# Altium project PCB_Project.PrjPcb
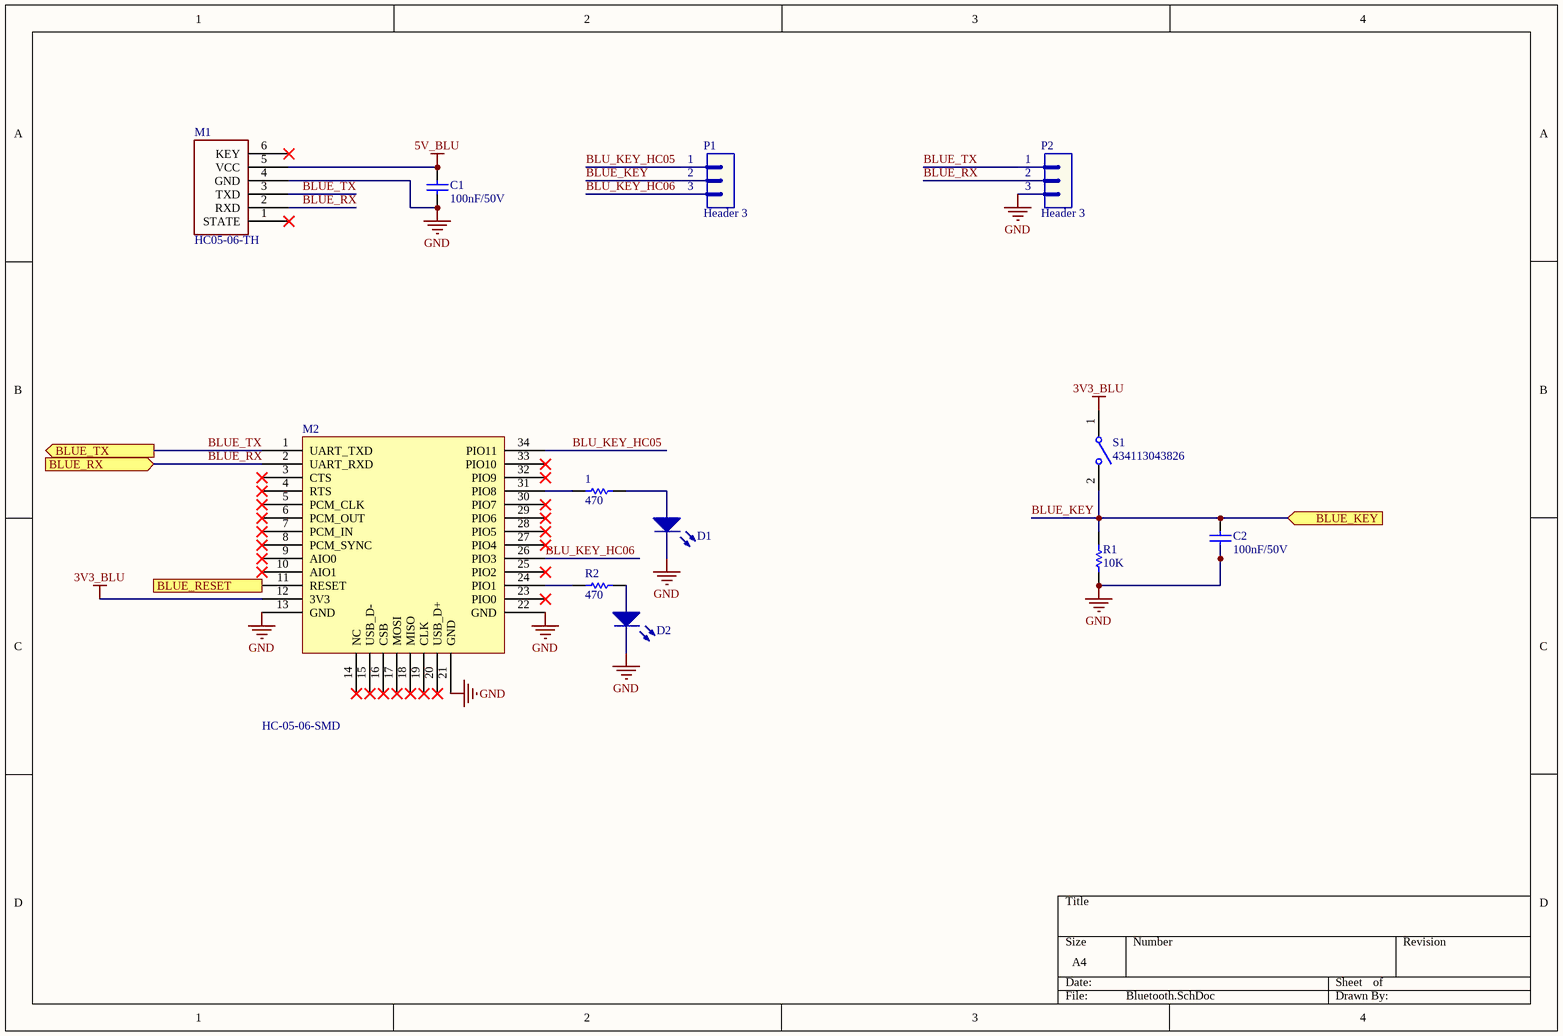
[diagram p0: Bluetooth.SchDoc]
5 sheets, 92 parts. Net scope: flat (ports and power ports of the same name join across sheets).
Board file: PCB1.PcbDoc
Sheets:
  Bluetooth.SchDoc
  MCU.SchDoc
  Motor Control.SchDoc
  Sensor.SchDoc
  Wifi.SchDoc

## Sheet Bluetooth.SchDoc
size A4

### Parts
1  value 470  [RES-SM-0805]  (hidden comment: Res-1K-0805)
C1  value 100nF/50V  [CAP-SM-0805]  (hidden comment: Cap-1nF-50V-0805)
C2  value 100nF/50V  [CAP-SM-0805]  (hidden comment: Cap-1nF-50V-0805)
D1  LED  [LED_0603_Blue]  (value not drawn)
D2  LED  [LED_0603_Blue]  (value not drawn)
M1  HC05-06-TH  [HC-05-06-TH]
M2  HC-05-06-SMD  [HC-05-06-SMD]
P1  Header 3  [JP3]
P2  Header 3  [JP3]
R1  value 10K  [RES-SM-0805]  (hidden comment: Res-0-0805)
R2  value 470  [RES-SM-0805]  (hidden comment: Res-1K-0805)
S1  434113043826  [434113043826]

### Ports
BLUE_KEY (in), BLUE_RESET (in), BLUE_RX (in), BLUE_TX (out)

### Nets
3V3_BLU: M2.12(3V3) S1.1
5V_BLU: C1.2 M1.5(VCC)
GND: C1.1 C2.1 D1.2(K) D2.2(K) M1.4(GND) M2.13(GND) M2.21(GND) M2.22(GND) P2.3 R1.2
BLU_KEY_HC05: M2.34(PIO11) P1.1
BLU_KEY_HC06: M2.26(PIO3) P1.3
BLUE_KEY: C2.2 P1.2 R1.1 S1.2 ; port BLUE_KEY
BLUE_RX: M1.2(RXD) M2.2(UART_RXD) P2.2 ; port BLUE_RX
BLUE_TX: M1.3(TXD) M2.1(UART_TXD) P2.1 ; port BLUE_TX
Net1_1: 1.1 M2.31(PIO8)
Net1_2: 1.2 D1.1(A)
NetCR1_14: M2.11(RESET) ; port BLUE_RESET
NetD2_1: D2.1(A) R2.2
NetM2_24: M2.24(PIO1) R2.1

Not connected (* = marked no-connect by the designer): M1 1(STATE)* 6(KEY)*; M2 3(CTS)* 4(RTS)* 5(PCM_CLK)* 6(PCM_OUT)* 7(PCM_IN)* 8(PCM_SYNC)* 9(AIO0)* 10(AIO1)* 14(NC)* 15(USB_D-)* 16(CSB)* 17(MOSI)* 18(MISO)* 19(CLK)* 20(USB_D+)* 23(PIO0)* 25(PIO2)* 27(PIO4)* 28(PIO5)* 29(PIO6)* 30(PIO7)* 32(PIO9)* 33(PIO10)*

### Library data of the parts
1 R2 = Res-1K-0805: RES 1K OHM 1% 1/4W 0805; Manufacturer: Stackpole Electronics Inc; Manufacturer Part Number: RNCP0805FTD1K00; Local Supplier: thegioiic; Local Supplier Link: https://thegioiic.com/products/dien-tro-1k-ohm-0805-5; Supplier 1: Digikey; Supplier 1 Link: https://www.digikey.com/product-detail/en/stackpole-electronics-inc/RNCP0805FTD1K00/RNCP0805FTD1K00CT-ND/2240568; Supplier 1 Part Number: RNCP0805FTD1K00CT-ND
C1 C2 = Cap-1nF-50V-0805: CAP CER 1000PF 100V X7R 0805; Manufacturer: Johanson Dielectrics Inc.; Manufacturer Part Number: 101X15W102MV4E; Local Supplier: thegioiic; Local Supplier Link: https://thegioiic.com/products/tu-1nf-50v-0805; Supplier 1: Digikey; Supplier 1 Link: https://www.digikey.com/product-detail/en/johanson-dielectrics-inc/101X15W102MV4E/709-1335-1-ND/2327235; Supplier 1 Part Number: 709-1335-1-ND
M2 = HC-05-06-SMD: Local supply: Hshop
P1 P2 = Header 3: Header, 3-Pin; LatestRevisionDate: 17-Jul-2002; LatestRevisionNote: Re-released for DXP Platform.; Publisher: Altium Limited
R1 = Res-0-0805: RES 0 OHM JUMPER 0805; Manufacturer: Vishay Dale; Manufacturer Part Number: WSL080500000ZEA9; Local Supplier: thegioiic; Local Supplier Link: https://thegioiic.com/products/dien-tro-0-ohm-0805-5; Supplier 1: Digikey; Supplier 1 Link: https://www.digikey.com/product-detail/en/vishay-dale/WSL080500000ZEA9/541-3928-1-ND/7423223; Supplier 1 Part Number: 541-3928-1-ND
S1 = 434113043826: WS-TASV J-Bend SMT Tact Switch 6x3.5mm, height 4.3mm, 260gf; Rated Voltage: 12VDC; Rated Current: 50mA; Washable: No; ComponentLink1Description: Manufacturer; ComponentLink1URL: http://www.we-online.de; ComponentLink2Description: Datasheet; ComponentLink2URL: https://katalog.we-online.com/em/datasheet/434113043826.pdf; Operating Temperature: -40 to +85degC; Part Number: 434113043826; Published Date: September 2019; Contact Material: Stainless Steel; Height: 4.3mm; Mounting Technology: SMT; Contact Plating: Silver; Operation Force: 260gf; Packaging: Tape and Reel; Terminal Material: Copper Alloy; Publisher: Wurth Elektronik; Terminal Plating: Silver

## Sheet MCU.SchDoc
size A4
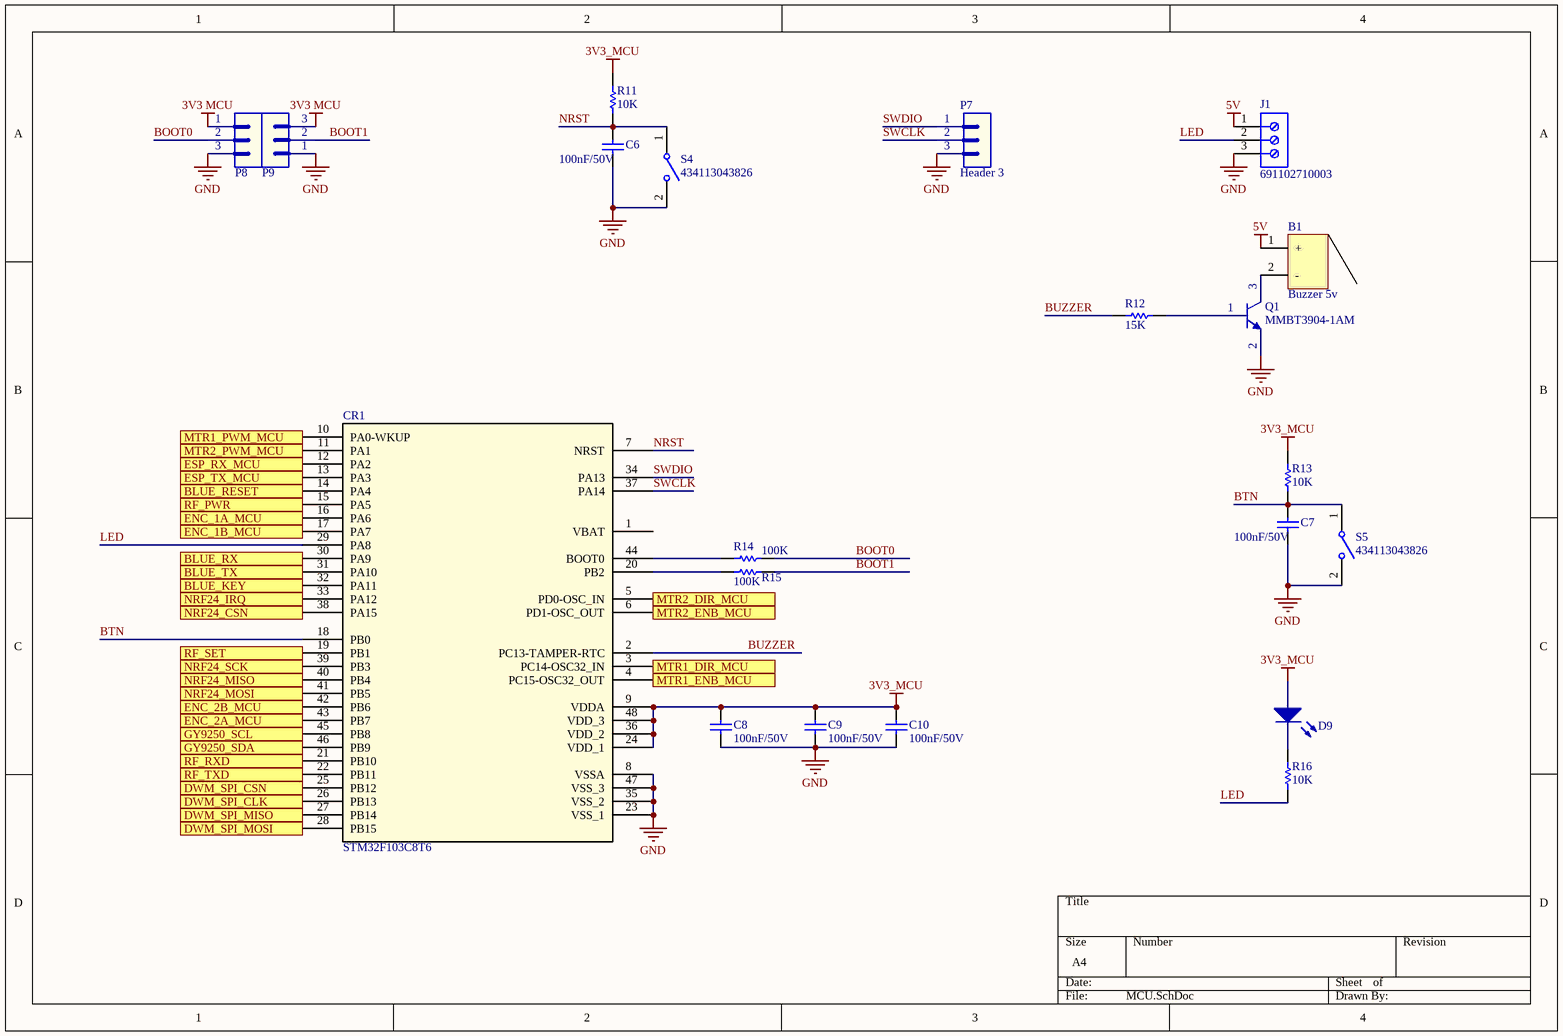
[diagram p1: MCU.SchDoc]

### Parts
B1  Buzzer 5v  [Buzzer 5v]
C6  value 100nF/50V  [CAP-SM-0805]  (hidden comment: Cap-1nF-50V-0805)
C7  value 100nF/50V  [CAP-SM-0805]  (hidden comment: Cap-1nF-50V-0805)
C8  value 100nF/50V  [CAP-SM-0805]  (hidden comment: Cap-1nF-50V-0805)
C9  value 100nF/50V  [CAP-SM-0805]  (hidden comment: Cap-1nF-50V-0805)
C10  value 100nF/50V  [CAP-SM-0805]  (hidden comment: Cap-1nF-50V-0805)
CR1  STM32F103C8T6  [STM32F103C8T6]
D9  LED  [LED_0603_Blue]  (value not drawn)
J1  691102710003  [691102710003]
P7  Header 3  [jp3]
P8  (no value)  [jp3]
P9  (no value)  [jp3]
Q1  MMBT3904-1AM  [SOT23_NEX]
R11  value 10K  [RES-SM-0805]  (hidden comment: Res-0-0805)
R12  value 15K  [RES-SM-0805]  (hidden comment: Res-12K-0805)
R13  value 10K  [RES-SM-0805]  (hidden comment: Res-0-0805)
R14  value 100K  [RES-SM-0805]  (hidden comment: Res-1K-0805)
R15  value 100K  [RES-SM-0805]  (hidden comment: Res-1K-0805)
R16  value 10K  [RES-SM-0805]  (hidden comment: Res-0-0805)
S4  434113043826  [434113043826]
S5  434113043826  [434113043826]

### Ports
BLUE_KEY (out), BLUE_RESET (out), BLUE_RX (out), BLUE_TX (in), DWM_SPI_CLK (out), DWM_SPI_CSN (out), DWM_SPI_MISO (in), DWM_SPI_MOSI (out), ENC_1A_MCU (in), ENC_1B_MCU (in), ENC_2A_MCU (in), ENC_2B_MCU (in), ESP_RX_MCU (out), ESP_TX_MCU (in), GY9250_SCL (out), GY9250_SDA (out), MTR1_DIR_MCU (out), MTR1_ENB_MCU (out), MTR1_PWM_MCU (out), MTR2_DIR_MCU (out), MTR2_ENB_MCU (out), MTR2_PWM_MCU (out), NRF24_CSN (out), NRF24_IRQ (in), NRF24_MISO (in), NRF24_MOSI (out), NRF24_SCK (out), RF_PWR (out), RF_RXD (out), RF_SET (out), RF_TXD (in)

### Nets
3V3 MCU: P8.1 P9.3
3V3_MCU: C8.2 C9.2 C10.2 CR1.9(VDDA) CR1.24(VDD_1) CR1.36(VDD_2) CR1.48(VDD_3) D9.1(A) R11.2 R13.2
5V: B1.1(+) J1.1
GND: C6.1 C7.1 C8.1 C9.1 C10.1 CR1.8(VSSA) CR1.23(VSS_1) CR1.35(VSS_2) CR1.47(VSS_3) J1.3 P7.3 P8.3 P9.1 Q1.2(E) S4.2 S5.2
BLUE_KEY: CR1.32(PA11) ; port BLUE_KEY
BLUE_RX: CR1.30(PA9) ; port BLUE_RX
BLUE_TX: CR1.31(PA10) ; port BLUE_TX
BOOT0: P8.2 R14.2
BOOT1: P9.2 R15.2
BTN: C7.2 CR1.18(PB0) R13.1 S5.1
BUZZER: CR1.2(PC13-TAMPER-RTC) R12.1
ESP_TX: CR1.13(PA3) ; port ESP_TX_MCU
LED: CR1.29(PA8) J1.2 R16.1
NRST: C6.2 CR1.7(NRST) R11.1 S4.1
SWCLK: CR1.37(PA14) P7.2
SWDIO: CR1.34(PA13) P7.1
NetB1_2: B1.2(-) Q1.3(C)
NetCR1_3: CR1.3(PC14-OSC32_IN) ; port MTR1_DIR_MCU
NetCR1_4: CR1.4(PC15-OSC32_OUT) ; port MTR1_ENB_MCU
NetCR1_5: CR1.5(PD0-OSC_IN) ; port MTR2_DIR_MCU
NetCR1_6: CR1.6(PD1-OSC_OUT) ; port MTR2_ENB_MCU
NetCR1_10: CR1.10(PA0-WKUP) ; port MTR1_PWM_MCU
NetCR1_11: CR1.11(PA1) ; port MTR2_PWM_MCU
NetCR1_12: CR1.12(PA2) ; port ESP_RX_MCU
NetCR1_14: CR1.14(PA4) ; port BLUE_RESET
NetCR1_15: CR1.15(PA5) ; port RF_PWR
NetCR1_16: CR1.16(PA6) ; port ENC_1A_MCU
NetCR1_17: CR1.17(PA7) ; port ENC_1B_MCU
NetCR1_19: CR1.19(PB1) ; port RF_SET
NetCR1_20: CR1.20(PB2) R15.1
NetCR1_21: CR1.21(PB10) ; port RF_RXD
NetCR1_22: CR1.22(PB11) ; port RF_TXD
NetCR1_25: CR1.25(PB12) ; port DWM_SPI_CSN
NetCR1_26: CR1.26(PB13) ; port DWM_SPI_CLK
NetCR1_27: CR1.27(PB14) ; port DWM_SPI_MISO
NetCR1_28: CR1.28(PB15) ; port DWM_SPI_MOSI
NetCR1_33: CR1.33(PA12) ; port NRF24_IRQ
NetCR1_38: CR1.38(PA15) ; port NRF24_CSN
NetCR1_39: CR1.39(PB3) ; port NRF24_SCK
NetCR1_40: CR1.40(PB4) ; port NRF24_MISO
NetCR1_41: CR1.41(PB5) ; port NRF24_MOSI
NetCR1_42: CR1.42(PB6) ; port ENC_2B_MCU
NetCR1_43: CR1.43(PB7) ; port ENC_2A_MCU
NetCR1_44: CR1.44(BOOT0) R14.1
NetCR1_45: CR1.45(PB8) ; port GY9250_SCL
NetCR1_46: CR1.46(PB9) ; port GY9250_SDA
NetD9_2: D9.2(K) R16.2
NetQ1_1: Q1.1(B) R12.2

Not connected (* = marked no-connect by the designer): CR1 1(VBAT)

### Library data of the parts
C6-C10 = Cap-1nF-50V-0805: as C1 on sheet Bluetooth; Local Supplier: thegioiic; Local Supplier Link: https://thegioiic.com/products/tu-1nf-50v-0805; Supplier 1: Digikey; Supplier 1 Link: https://www.digikey.com/product-detail/en/johanson-dielectrics-inc/101X15W102MV4E/709-1335-1-ND/2327235; Supplier 1 Part Number: 709-1335-1-ND
CR1 = STM32F103C8T6: SourceLibrary: StMicro_2011-06-07; Built_By: EMA_UL_Team; Vendor: STMicroelectronics; Type: DEV; Manufacturer_Part_Number: STM32F103C8T6; Copyright: Copyright (C) 2018 Accelerated Designs. All rights reserved; RefDes: RefDes
J1 = 691102710003: WR-TBL Serie 102 Horizontal Entry Modular, Pressure Clamp, pitch 5mm, 3p; Compliance: Lead free / RoHS; Modularity: Yes; PCB/Cable/Panel: PCB; Pin Number: 3; Rated Current [UL]: 15A; Working Voltage [UL]: 250VAC; ComponentLink1Description: Manufacturer; ComponentLink1URL: http://www.we-online.de; ComponentLink2URL: https://katalog.we-online.de/em/datasheet/691102710003.pdf; ComponentLink2Description: Datasheet; Mounting Technology: THT; Part Number: 691102710003; Packaging: Box; Operating Temperature: -40 to +105degC; Pitch: 5mm; Published Date: October 2019; Type: Horizontal; Publisher: Wurth Elektronik; Application: Pressure Clamp
P7-P9 = Header 3: Header, 3-Pin; LatestRevisionDate: 17-Jul-2002; LatestRevisionNote: Re-released for DXP Platform.; Publisher: Altium Limited
R11 R13 R16 = Res-0-0805: as R1 on sheet Bluetooth; Local Supplier: thegioiic; Local Supplier Link: https://thegioiic.com/products/dien-tro-0-ohm-0805-5; Supplier 1: Digikey; Supplier 1 Link: https://www.digikey.com/product-detail/en/vishay-dale/WSL080500000ZEA9/541-3928-1-ND/7423223; Supplier 1 Part Number: 541-3928-1-ND
R12 = Res-12K-0805: RES 12 KOHM JUMPER 0805; Manufacturer: Vishay Thin Film; Manufacturer Part Number: PAT0805E3121BST1; Local Supplier: icdayroi; Local Supplier Link: https://icdayroi.com/dien-tro-12k-0805-1-goi-50-con; Supplier 1: Digikey; Supplier 1 Link: https://www.digikey.com/product-detail/en/vishay-thin-film/PAT0805E3121BST1/PAT0805E3121BST1-ND/2281536; Supplier 1 Part Number: PAT0805E3121BST1-ND
R14 R15 = Res-1K-0805: as 1 on sheet Bluetooth; Local Supplier: thegioiic; Local Supplier Link: https://thegioiic.com/products/dien-tro-1k-ohm-0805-5; Supplier 1: Digikey; Supplier 1 Link: https://www.digikey.com/product-detail/en/stackpole-electronics-inc/RNCP0805FTD1K00/RNCP0805FTD1K00CT-ND/2240568; Supplier 1 Part Number: RNCP0805FTD1K00CT-ND
S4 S5 = 434113043826: as S1 on sheet Bluetooth; ComponentLink1Description: Manufacturer; ComponentLink1URL: http://www.we-online.de; ComponentLink2Description: Datasheet; ComponentLink2URL: https://katalog.we-online.com/em/datasheet/434113043826.pdf; Operating Temperature: -40 to +85degC; Part Number: 434113043826; Published Date: September 2019; Contact Material: Stainless Steel; Height: 4.3mm; Mounting Technology: SMT; Contact Plating: Silver; Operation Force: 260gf; Packaging: Tape and Reel; Terminal Material: Copper Alloy; Publisher: Wurth Elektronik; Terminal Plating: Silver

## Sheet Motor Control.SchDoc
size A4
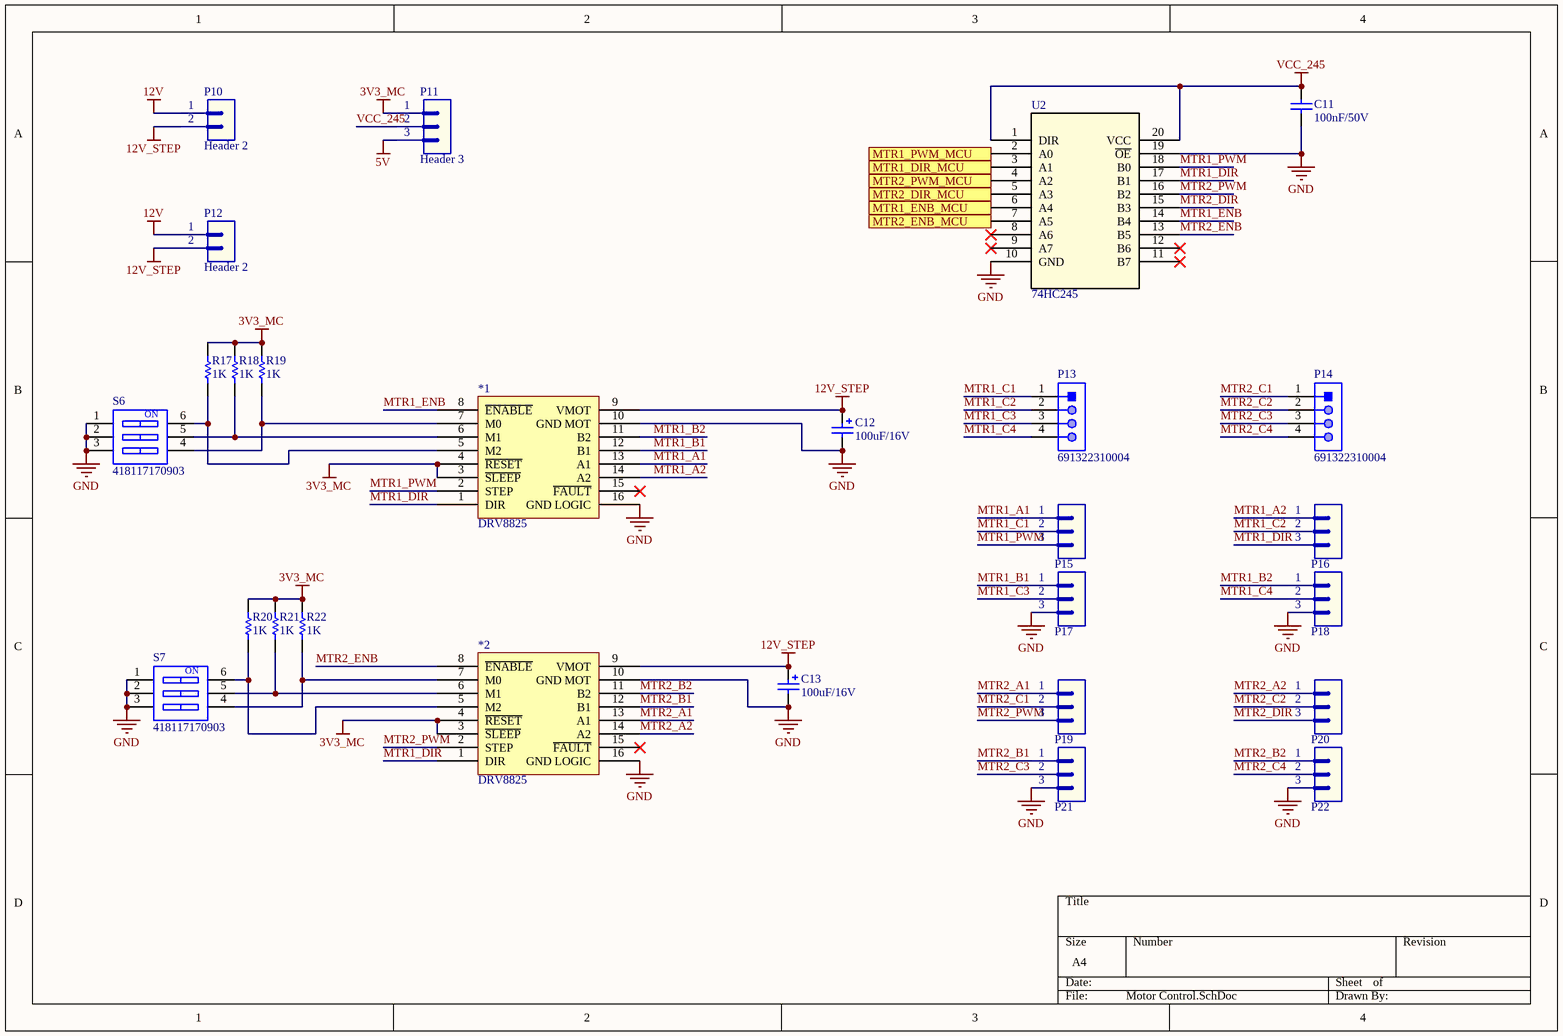
[diagram p2: Motor Control.SchDoc]

### Parts
*1  DRV8825  [DRV8825]
*2  DRV8825  [DRV8825]
C11  value 100nF/50V  [CAP-SM-0805]  (hidden comment: Cap-10uF-50V-0805)
C12  value 100uF/16V  [CAP-SM-AL-SIZE-D-D6L6]  (hidden comment: Cap-Al-100uF-16V-D6L5)
C13  value 100uF/16V  [CAP-SM-AL-SIZE-D-D6L6]  (hidden comment: Cap-Al-220uF-35V-D8L10)
P10  Header 2  [JP2]
P11  Header 3  [JP3]
P12  Header 2  [JP2]
P13  691322310004  [691322310004]
P14  691322310004  [691322310004]
P15  Header 3  [JP3]  (value not drawn)
P16  Header 3  [JP3]  (value not drawn)
P17  Header 3  [JP3]  (value not drawn)
P18  Header 3  [JP3]  (value not drawn)
P19  Header 3  [JP3]  (value not drawn)
P20  Header 3  [JP3]  (value not drawn)
P21  Header 3  [JP3]  (value not drawn)
P22  Header 3  [JP3]  (value not drawn)
R17  value 1K  [RES-SM-0805]  (hidden comment: Res-1K-0805)
R18  value 1K  [RES-SM-0805]  (hidden comment: Res-1K-0805)
R19  value 1K  [RES-SM-0805]  (hidden comment: Res-1K-0805)
R20  value 1K  [RES-SM-0805]  (hidden comment: Res-1K-0805)
R21  value 1K  [RES-SM-0805]  (hidden comment: Res-1K-0805)
R22  value 1K  [RES-SM-0805]  (hidden comment: Res-1K-0805)
S6  418117170903  [418117170903]
S7  418117170903  [418117170903]
U2  74HC245  [74HC245,625]

### Ports
MTR1_DIR_MCU (in), MTR1_ENB_MCU (in), MTR1_PWM_MCU (in), MTR2_DIR_MCU (in), MTR2_ENB_MCU (in), MTR2_PWM_MCU (in)

### Nets
3V3_MC: *1.3(~{SLEEP}) *1.4(~{RESET}) *2.3(~{SLEEP}) *2.4(~{RESET}) P11.1 R17.2 R18.2 R19.2 R20.2 R21.2 R22.2
5V: P11.3
12V: P10.1 P12.1
12V_STEP: *1.9(VMOT) *2.9(VMOT) C12.1 C13.2 P10.2 P12.2
GND: *1.10(GND_MOT) *1.16(GND_LOGIC) *2.10(GND_MOT) *2.16(GND_LOGIC) C11.1 C12.2 C13.1 P17.3 P18.3 P21.3 P22.3 S6.1 S6.2 S6.3 S7.1 S7.2 S7.3 U2.10(GND) U2.19(~{OE})
VCC_245: C11.2 P11.2 U2.1(DIR) U2.20(VCC)
MTR1_A1: *1.13(A1) P15.1
MTR1_A2: *1.14(A2) P16.1
MTR1_B1: *1.12(B1) P17.1
MTR1_B2: *1.11(B2) P18.1
MTR1_C1: P13.1 P15.2
MTR1_C2: P13.2 P16.2
MTR1_C3: P13.3 P17.2
MTR1_C4: P13.4 P18.2
MTR1_DIR: *1.1(DIR) *2.1(DIR) P16.3 U2.17(B1)
MTR1_ENB: *1.8(~{ENABLE}) U2.14(B4)
MTR1_PWM: *1.2(STEP) P15.3 U2.18(B0)
MTR2_A1: *2.13(A1) P19.1
MTR2_A2: *2.14(A2) P20.1
MTR2_B1: *2.12(B1) P21.1
MTR2_B2: *2.11(B2) P22.1
MTR2_C1: P14.1 P19.2
MTR2_C2: P14.2 P20.2
MTR2_C3: P14.3 P21.2
MTR2_C4: P14.4 P22.2
MTR2_DIR: P20.3 U2.15(B3)
MTR2_ENB: *2.8(~{ENABLE}) U2.13(B5)
MTR2_PWM: *2.2(STEP) P19.3 U2.16(B2)
Net*1_5: *1.5(M2) R17.1 S6.6
Net*1_6: *1.6(M1) R18.1 S6.5
Net*1_7: *1.7(M0) R19.1 S6.4
Net*2_5: *2.5(M2) R20.1 S7.6
Net*2_6: *2.6(M1) R21.1 S7.5
Net*2_7: *2.7(M0) R22.1 S7.4
NetCR1_3: U2.3(A1) ; port MTR1_DIR_MCU
NetCR1_4: U2.6(A4) ; port MTR1_ENB_MCU
NetCR1_5: U2.5(A3) ; port MTR2_DIR_MCU
NetCR1_6: U2.7(A5) ; port MTR2_ENB_MCU
NetCR1_10: U2.2(A0) ; port MTR1_PWM_MCU
NetCR1_11: U2.4(A2) ; port MTR2_PWM_MCU

Not connected (* = marked no-connect by the designer): *1 15(~{FAULT})*; *2 15(~{FAULT})*; U2 8(A6)* 9(A7)* 11(B7)* 12(B6)*

### Notes on the sheet
- (in symbol 418117170903) ON

### Library data of the parts
C11 = Cap-10uF-50V-0805: CAP CER 10UF 50V X5R 0805; Manufacturer: Yageo; Manufacturer Part Number: CC0805KKX5R9BB106; Local Supplier: thegioiic; Local Supplier Link: https://thegioiic.com/products/tu-10uf-50v-0805; Supplier 1: Digikey; Supplier 1 Link: https://www.digikey.com/product-detail/en/yageo/CC0805KKX5R9BB106/311-3499-2-ND/7164383; Supplier 1 Part Number: 311-3499-2-ND
C12 C13 = Cap-Al-100uF-16V-D6L5: CAP ALUM 100UF 20% 16V SMD; Manufacturer: Nichicon; Manufacturer Part Number: UWX1C101MCL1GB; Local Supplier: thegioiic; Local Supplier Link: https://thegioiic.com/products/tu-nhom-smd-100uf-16v-d6-3l5-4; Supplier 1: Digikey; Supplier 1 Part Number: 493-2105-1-ND; Supplier 1 Link: https://www.digikey.com/product-detail/en/nichicon/UWX1C101MCL1GB/493-2105-1-ND/590080
P10 P12 = Header 2: Header, 2-Pin; LatestRevisionDate: 17-Jul-2002; LatestRevisionNote: Re-released for DXP Platform.; Publisher: Altium Limited
P11 P15-P22 = Header 3: Header, 3-Pin; LatestRevisionDate: 17-Jul-2002; LatestRevisionNote: Re-released for DXP Platform.; Publisher: Altium Limited
P13 P14 = 691322310004: WR-TBL Serie 322 Horizontal PCB Header, Pluggable, pitch 3.81mm, 4p; Compliance: RoHS; Modularity: No; Pin Number: 4; Rated Current [UL]: 10A; Working Voltage [UL]: 300VAC; ComponentLink1Description: Manufacturer; ComponentLink1URL: http://www.we-online.de; ComponentLink2URL: https://katalog.we-online.de/em/datasheet/691322310004.pdf; ComponentLink2Description: Datasheet; Mounting Technology: THT; Part Number: 691322310004; Packaging: Box; Operating Temperature: -40 to +105degC; PCB/Cable/Panel: PCB; Pitch: 3.81mm; Published Date: October 2019; Type: Horizontal; Publisher: Wurth Elektronik; Application: Pluggable
R17-R22 = Res-1K-0805: as 1 on sheet Bluetooth; Local Supplier: thegioiic; Local Supplier Link: https://thegioiic.com/products/dien-tro-1k-ohm-0805-5; Supplier 1: Digikey; Supplier 1 Link: https://www.digikey.com/product-detail/en/stackpole-electronics-inc/RNCP0805FTD1K00/RNCP0805FTD1K00CT-ND/2240568; Supplier 1 Part Number: RNCP0805FTD1K00CT-ND
S6 S7 = 418117170903: WS-DITV Compact THT Dip Switch, Flat Actuator, pitch 2.54mm, 3p; Operation Force: 800g; Pole Number: 3; Actuator Type: Flat Type; Circuit: SPST-NO; Rated Current Switching: 25mA; Rated Current Non-Switching: 100mA; Rated Voltage Non-Switching: 50VDC; Rated Voltage Switching: 24VDC; ComponentLink1Description: Manufacturer; ComponentLink1URL: http://www.we-online.de; ComponentLink2Description: Datasheet; ComponentLink2URL: https://katalog.we-online.com/em/datasheet/418117170903.pdf; Pitch: 2.54mm; Contact Material: Copper Alloy; Mounting Technology: THT; Operating Temperature: -40 to +85degC; Contact Plating: Gold; Packaging: Tube; Part Number: 418117170903; Publisher: Wurth Elektronik; Published Date: September 2019
U2 = 74HC245: No Description Available; Vendor: Texas Instruments; Built_By: EMA_UL_Team; SourceLibrary: TI_2002-01-01_7; Manufacturer_Part_Number: 74HC245; Copyright: Copyright (C) 2018 Accelerated Designs. All rights reserved; RefDes: RefDes; Type: DEV

## Sheet Sensor.SchDoc
size A4
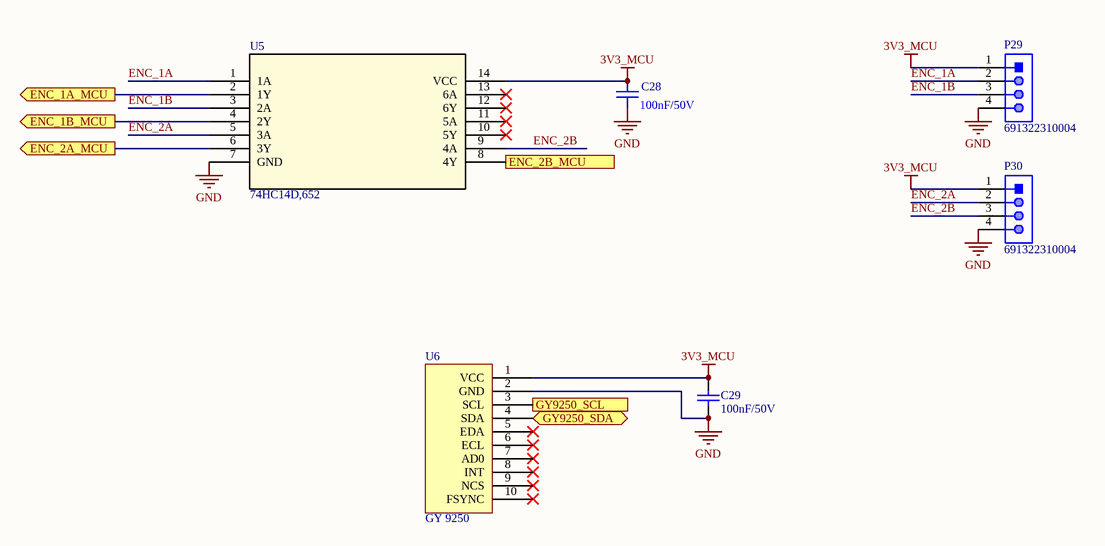
[diagram p3: Sensor.SchDoc]

### Parts
C28  value 100nF/50V  [CAP-SM-0805]  (hidden comment: Cap Non-Pol SMD)
C29  value 100nF/50V  [CAP-SM-0805]  (hidden comment: Cap-1nF-50V-0805)
P29  691322310004  [691322310004]
P30  691322310004  [691322310004]
U5  74HC14D,652  [74HC14D,652]
U6  GY 9250  [GY 9250]

### Ports
ENC_1A_MCU (out), ENC_1B_MCU (out), ENC_2A_MCU (out), ENC_2B_MCU (out), GY9250_SCL (in), GY9250_SDA (bidir)

### Nets
3V3_MCU: C28.2 C29.2 P29.1 P30.1 U5.14(VCC) U6.1(VCC)
GND: C28.1 C29.1 P29.4 P30.4 U5.7(GND) U6.2(GND)
ENC_1A: P29.2 U5.1(1A)
ENC_1B: P29.3 U5.3(2A)
ENC_2A: P30.2 U5.5(3A)
ENC_2B: P30.3 U5.9(4A)
NetCR1_16: U5.2(1Y) ; port ENC_1A_MCU
NetCR1_17: U5.4(2Y) ; port ENC_1B_MCU
NetCR1_42: U5.8(4Y) ; port ENC_2B_MCU
NetCR1_43: U5.6(3Y) ; port ENC_2A_MCU
NetCR1_45: U6.3(SCL) ; port GY9250_SCL
NetCR1_46: U6.4(SDA) ; port GY9250_SDA

Not connected (* = marked no-connect by the designer): U5 10(5Y)* 11(5A)* 12(6Y)* 13(6A)*; U6 5(EDA)* 6(ECL)* 7(AD0)* 8(INT)* 9(NCS)* 10(FSYNC)*

### Library data of the parts
C28 = Cap Non-Pol SMD: Capacitor
C29 = Cap-1nF-50V-0805: as C1 on sheet Bluetooth; Local Supplier: thegioiic; Local Supplier Link: https://thegioiic.com/products/tu-1nf-50v-0805; Supplier 1: Digikey; Supplier 1 Link: https://www.digikey.com/product-detail/en/johanson-dielectrics-inc/101X15W102MV4E/709-1335-1-ND/2327235; Supplier 1 Part Number: 709-1335-1-ND
P29 P30 = 691322310004: as P13 on sheet Motor Control; ComponentLink1Description: Manufacturer; ComponentLink1URL: http://www.we-online.de; ComponentLink2URL: https://katalog.we-online.de/em/datasheet/691322310004.pdf; ComponentLink2Description: Datasheet; Mounting Technology: THT; Part Number: 691322310004; Packaging: Box; Operating Temperature: -40 to +105degC; PCB/Cable/Panel: PCB; Pitch: 3.81mm; Published Date: October 2019; Type: Horizontal; Publisher: Wurth Elektronik; Application: Pluggable
U5 = 74HC14D,652: Vendor: Nexperia; SourceLibrary: Nexperia_2018-05-2018; Manufacturer_Part_Number: 74HC14D,652; Copyright: Copyright (C) 2016 Accelerated Designs. All rights reserved; RefDes: RefDes; Type: DEV

## Sheet Wifi.SchDoc
size A4
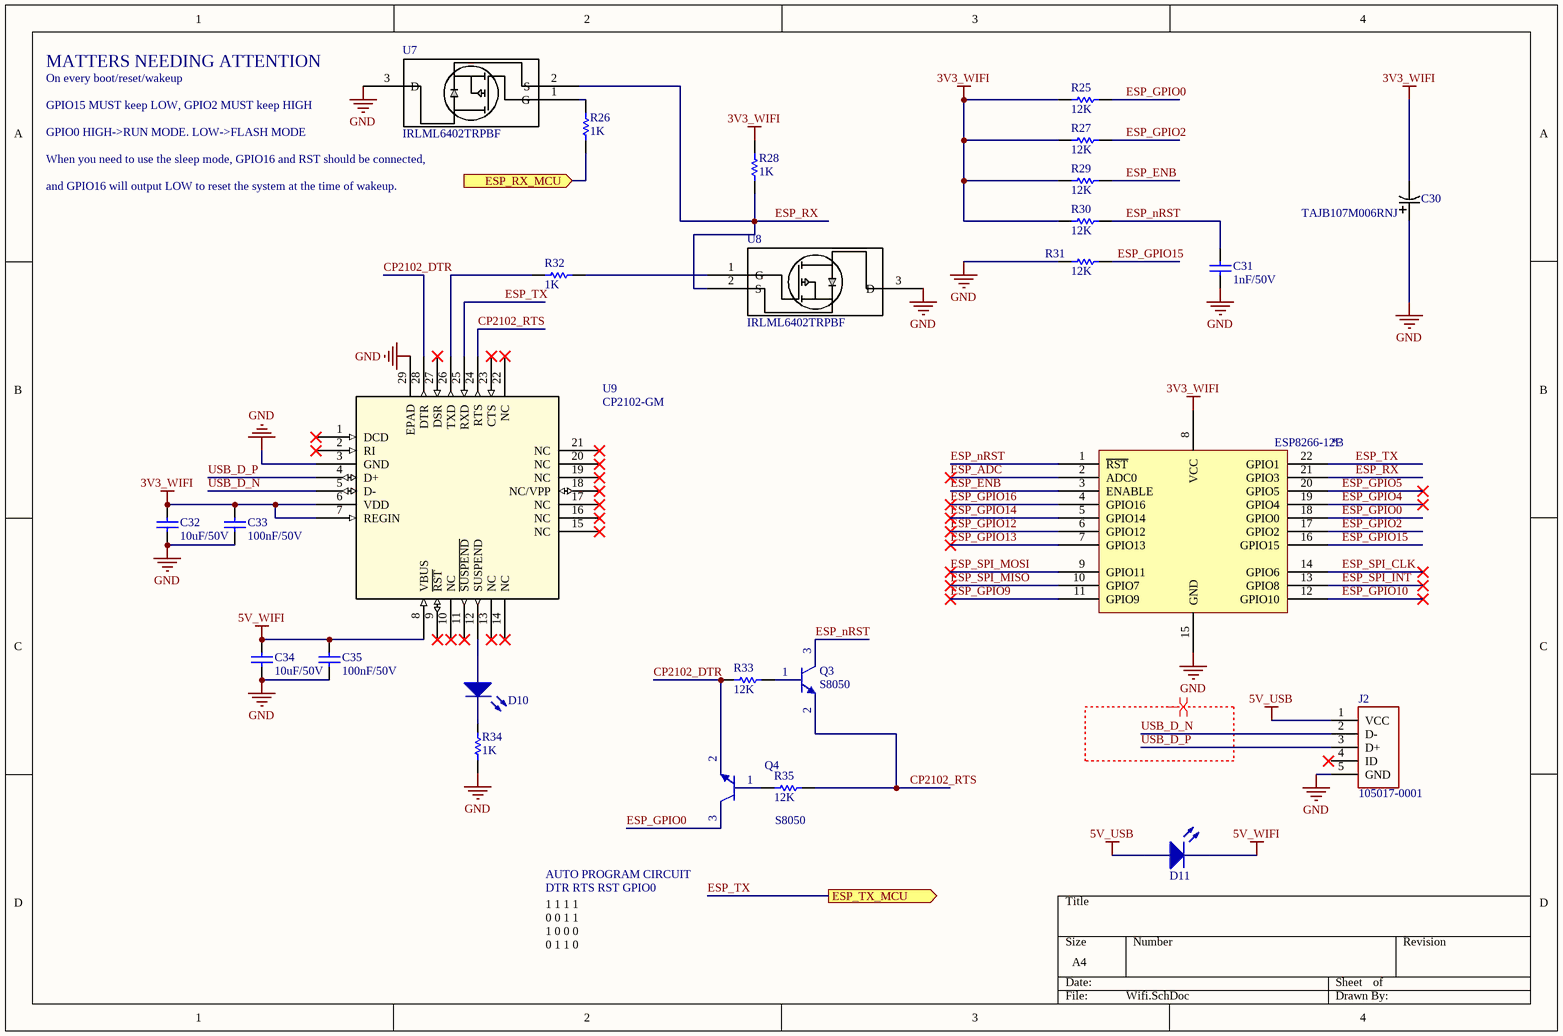
[diagram p4: Wifi.SchDoc]

### Parts
*3  ESP8266-12F  [ESP8266]
C30  TAJB107M006RNJ  [TAJB107M006RNJ]
C31  value 1nF/50V  [CAP-SM-0805]  (hidden comment: Cap-1nF-50V-0805)
C32  value 10uF/50V  [CAP-SM-0805]  (hidden comment: Cap-1nF-50V-0805)
C33  value 100nF/50V  [CAP-SM-0805]  (hidden comment: Cap-1nF-50V-0805)
C34  value 10uF/50V  [CAP-SM-0805]  (hidden comment: Cap-1nF-50V-0805)
C35  value 100nF/50V  [CAP-SM-0805]  (hidden comment: Cap-1nF-50V-0805)
D10  LED  [LED_0603_Blue]  (value not drawn)
D11  LED  [LED_0603_Blue]  (value not drawn)
J2  105017-0001  [CONN_105017-0001]
Q3  S8050  [SOT23_NEX]
Q4  S8050  [SOT23_NEX]
R25  value 12K  [RES-SM-0805]  (hidden comment: Res-0-0805)
R26  value 1K  [RES-SM-0805]  (hidden comment: Res-470-0805)
R27  value 12K  [RES-SM-0805]  (hidden comment: Res-0-0805)
R28  value 1K  [RES-SM-0805]  (hidden comment: Res-470-0805)
R29  value 12K  [RES-SM-0805]  (hidden comment: Res-0-0805)
R30  value 12K  [RES-SM-0805]  (hidden comment: Res-0-0805)
R31  value 12K  [RES-SM-0805]  (hidden comment: Res-0-0805)
R32  value 1K  [RES-SM-0805]  (hidden comment: Res-470-0805)
R33  value 12K  [RES-SM-0805]  (hidden comment: Res-0-0805)
R34  value 1K  [RES-SM-0805]  (hidden comment: Res-470-0805)
R35  value 12K  [RES-SM-0805]  (hidden comment: Res-0-0805)
U7  IRLML6402TRPBF  [IRLML6402TRPBF]
U8  IRLML6402TRPBF  [IRLML6402TRPBF]
U9  CP2102-GM  [cp2102-gm]

### Ports
ESP_RX_MCU (in), ESP_TX_MCU (out)

### Nets
3V3_WIFI: *3.8(VCC) C30.2 C32.2 C33.2 R25.1 R27.1 R28.1 R29.1 R30.1 U9.6(VDD) U9.7(REGIN)
5V_USB: D11.1(A) J2.1(VCC)
5V_WIFI: C34.2 C35.2 D11.2(K) U9.8(VBUS)
GND: *3.15(GND) C30.1 C31.1 C32.1 C33.1 C34.1 C35.1 J2.5(GND) R31.1 R34.1 U7.3(D) U8.3(D) U9.3(GND) U9.29(EPAD)
CP2102_DTR: Q4.2(E) R33.1 U9.28(DTR)
CP2102_RTS: Q3.2(E) R35.2 U9.24(RTS)
ESP_ADC: *3.2(ADC0)
ESP_ENB: *3.3(ENABLE) R29.2
ESP_GPIO0: *3.18(GPIO0) Q4.3(C) R25.2
ESP_GPIO2: *3.17(GPIO2) R27.2
ESP_GPIO4: *3.19(GPIO4)
ESP_GPIO5: *3.20(GPIO5)
ESP_GPIO9: *3.11(GPIO9)
ESP_GPIO10: *3.12(GPIO10)
ESP_GPIO12: *3.6(GPIO12)
ESP_GPIO13: *3.7(GPIO13)
ESP_GPIO14: *3.5(GPIO14)
ESP_GPIO15: *3.16(GPIO15) R31.2
ESP_GPIO16: *3.4(GPIO16)
ESP_nRST: *3.1(~{RST}) C31.2 Q3.3(C) R30.2
ESP_RX: *3.21(GPIO3) R28.2 U7.2(S) U8.2(S)
ESP_SPI_CLK: *3.14(GPIO6)
ESP_SPI_INT: *3.13(GPIO8)
ESP_SPI_MISO: *3.10(GPIO7)
ESP_SPI_MOSI: *3.9(GPIO11)
ESP_TX: *3.22(GPIO1) U9.25(RXD) ; port ESP_TX_MCU
USB_D_N: J2.2(D-) U9.5(D-)
USB_D_P: J2.3(D+) U9.4(D+)
NetCR1_12: R26.1 ; port ESP_RX_MCU
NetD10_1: D10.1(A) U9.12(SUSPEND)
NetD10_2: D10.2(K) R34.2
NetQ3_1: Q3.1(B) R33.2
NetQ4_1: Q4.1(B) R35.1
NetR26_2: R26.2 U7.1(G)
NetR32_1: R32.1 U8.1(G)
NetR32_2: R32.2 U9.26(TXD)

Not connected (* = marked no-connect by the designer): J2 4(ID); U9 1(DCD)* 2(RI)* 9(~{RST})* 10(NC)* 11(~{SUSP}~{END})* 13(NC)* 14(NC)* 15(NC)* 16(NC)* 17(NC)* 18(NC/VPP)* 19(NC)* 20(NC)* 21(NC)* 22(NC)* 23(CTS)* 27(DSR)*

### Layout directives
differential pair: (no net found under the mark)

### Notes on the sheet
- MATTERS NEEDING ATTENTION
- On every boot/reset/wakeup
- GPIO15 MUST keep LOW, GPIO2 MUST keep HIGH
- GPIO0 HIGH->RUN MODE. LOW->FLASH MODE
- When you need to use the sleep mode, GPIO16 and RST should be connected,
- and GPIO16 will output LOW to reset the system at the time of wakeup.
- AUTO PROGRAM CIRCUIT
- DTR RTS RST GPIO0
- 1 1 1 1
  0 0 1 1
  1 0 0 0
  0 1 1 0

### Library data of the parts
*3 = ESP8266-12F: Local supply: Hshop; Local supply link: https://www.elecrow.com/download/ESP-12F.pdf
C30 = TAJB107M006RNJ: Vendor: AVX Corporation; Built_By: EMA_UL_Team; SourceLibrary: AVX_2015-1-12; Type: DEV; Manufacturer_Part_Number: TAJB107M006RNJ; Copyright: Copyright (C) 2018 Accelerated Designs. All rights reserved; RefDes: RefDes
C31-C35 = Cap-1nF-50V-0805: as C1 on sheet Bluetooth; Local Supplier: thegioiic; Local Supplier Link: https://thegioiic.com/products/tu-1nf-50v-0805; Supplier 1: Digikey; Supplier 1 Link: https://www.digikey.com/product-detail/en/johanson-dielectrics-inc/101X15W102MV4E/709-1335-1-ND/2327235; Supplier 1 Part Number: 709-1335-1-ND
J2 = 105017-0001: No Description Available; Vendor: Molex Connector Corporation; Built_By: EMA_Cory; SourceLibrary: Molex_2020-05-26; Datasheet: https://www.molex.com/pdm_docs/sd/1050170001_sd.pdf; Manufacturer_Part_Number: 105017-0001; Copyright: Copyright (C) 2018 Accelerated Designs. All rights reserved; RefDes: RefDes; Type: DEV
R25 R27 R29-R31 R33 R35 = Res-0-0805: as R1 on sheet Bluetooth; Local Supplier: thegioiic; Local Supplier Link: https://thegioiic.com/products/dien-tro-0-ohm-0805-5; Supplier 1: Digikey; Supplier 1 Link: https://www.digikey.com/product-detail/en/vishay-dale/WSL080500000ZEA9/541-3928-1-ND/7423223; Supplier 1 Part Number: 541-3928-1-ND
R26 R28 R32 R34 = Res-470-0805: RES 470 OHM JUMPER 0805; Manufacturer: YAG6006CT-ND; Manufacturer Part Number: PE0805FRF7W0R047L; Local Supplier: thegioiic; Local Supplier Link: https://www.thegioiic.com/products/dien-tro-470-kohm-0805-5; Supplier 1: Digikey; Supplier 1 Link: https://www.digikey.com/product-detail/en/yageo/PE0805FRF7W0R047L/YAG6006CT-ND/9696460; Supplier 1 Part Number: YAG6006CT-ND
U7 U8 = IRLML6402TRPBF: No Description Available; Source_Library: Infineon_2020-02-27.xlr; Built_By: EMA_Justin; SourceLibrary: Infineon_2020-02-27; Vendor: Infineon; Copyright: Copyright (C) 2018 Accelerated Designs. All rights reserved; Manufacturer_Part_Number: IRLML6402TRPBF; RefDes: RefDes; Type: DEV
U9 = CP2102-GM: Vendor: Silicon Labs; Built_By: EMA_UL_Team; SourceLibrary: Silicon_Labs_2015-03-23; Manufacturer_Part_Number: CP2102-GM; Copyright: Copyright (C) 2018 Accelerated Designs. All rights reserved; RefDes: RefDes; Type: DEV

## Nets that join several sheets
3V3_MCU: MCU (10 pins), Sensor (6 pins)
5V: MCU (B1.1 J1.1), Motor Control (P11.3)
GND: Bluetooth (10 pins), MCU (16 pins), Motor Control (19 pins), Sensor (6 pins), Wifi (14 pins)
BLUE_KEY: Bluetooth (C2.2 P1.2 R1.1 S1.2), MCU (CR1.32)
BLUE_RX: Bluetooth (M1.2 M2.2 P2.2), MCU (CR1.30)
BLUE_TX: Bluetooth (M1.3 M2.1 P2.1), MCU (CR1.31)
ESP_TX: MCU (CR1.13), Wifi (*3.22 U9.25)
NetCR1_3: MCU (CR1.3), Motor Control (U2.3)
NetCR1_4: MCU (CR1.4), Motor Control (U2.6)
NetCR1_5: MCU (CR1.5), Motor Control (U2.5)
NetCR1_6: MCU (CR1.6), Motor Control (U2.7)
NetCR1_10: MCU (CR1.10), Motor Control (U2.2)
NetCR1_11: MCU (CR1.11), Motor Control (U2.4)
NetCR1_12: MCU (CR1.12), Wifi (R26.1)
NetCR1_14: Bluetooth (M2.11), MCU (CR1.14)
NetCR1_16: MCU (CR1.16), Sensor (U5.2)
NetCR1_17: MCU (CR1.17), Sensor (U5.4)
NetCR1_42: MCU (CR1.42), Sensor (U5.8)
NetCR1_43: MCU (CR1.43), Sensor (U5.6)
NetCR1_45: MCU (CR1.45), Sensor (U6.3)
NetCR1_46: MCU (CR1.46), Sensor (U6.4)